# EAGLE design battery_18650_shield (EAGLE 9.5.2)
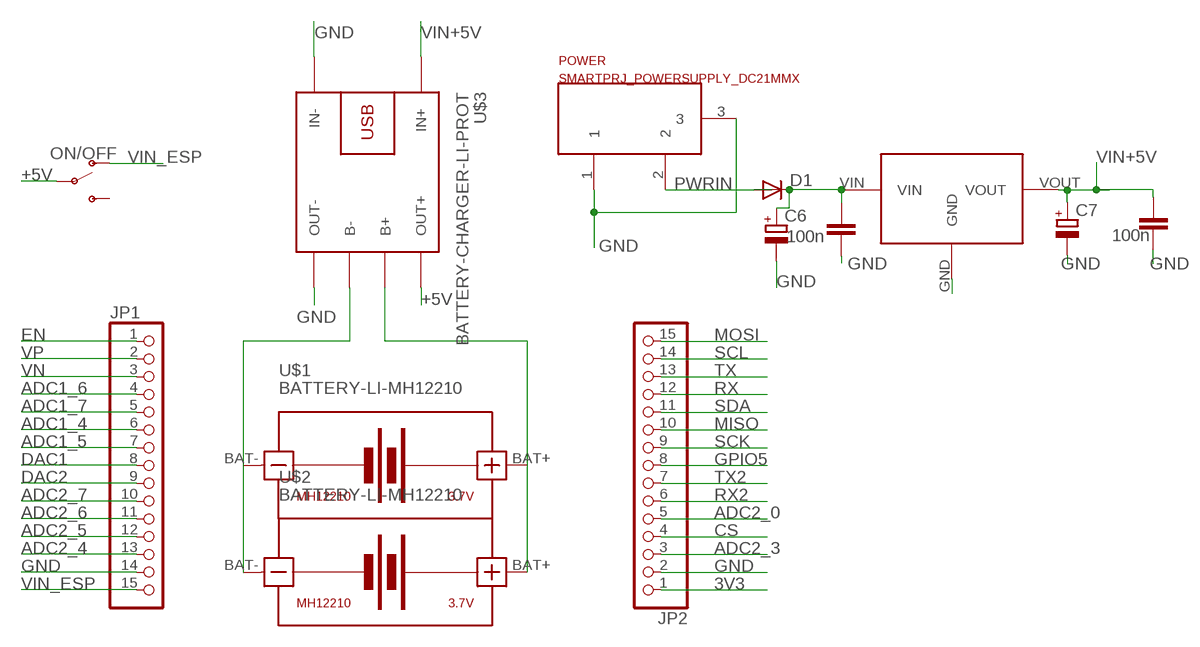
[diagram p0: schematic, sheet 1]

## Parts
C5  100n  C-EUC1206  [C1206]
C6  CPOL-EUD  [PANASONIC_D]
C7  CPOL-EUD  [PANASONIC_D]
C14  100n  C-EUC1206  [C1206]
D1  DIODE-SMB  [SMB]
JP1  PINHD-1X15  [1X15]
JP2  PINHD-1X15  [1X15]
ON/OFF  SWITCH-SPDT-PTH-11.6X4.0MM  [SWITCH_SPDT_PTH_11.6X4.0MM]
POWER  SMARTPRJ_POWERSUPPLY_DC21MMX  [SMARTPRJ_POWERSUPPLY_DC-21MM]
U$1  BATTERY-LI-MH12210  [BATTERY-LI-MH12210]
U$2  BATTERY-LI-MH12210  [BATTERY-LI-MH12210]
U$3  BATTERY-CHARGER-LI-PROT  [BATTERY-CHARGER-LI-PROT]
U$5  7805-TO263_7805  [7805-TO263_TO263]

## Nets
3V3: JP2.1
+5V [usbvcc]: ON/OFF.2(P) U$3.OUT+
ADC1_4: JP1.6
ADC1_5: JP1.7
ADC1_6: JP1.4
ADC1_7: JP1.5
ADC2_0: JP2.5
ADC2_3: JP2.3
ADC2_4: JP1.13
ADC2_5: JP1.12
ADC2_6: JP1.11
ADC2_7: JP1.10
CS: JP2.4
DAC1: JP1.8
DAC2: JP1.9
EN: JP1.1
GND: C5.1 C6.- C7.- C14.1 JP1.14 JP2.2 POWER.1 POWER.3 U$3.IN- U$3.OUT- U$5.GND
GPIO5: JP2.8
MISO: JP2.10
MOSI: JP2.15
N$1: U$1.BAT- U$2.BAT- U$3.B-
N$2: U$1.BAT+ U$2.BAT+ U$3.B+
PWRIN [power]: D1.A POWER.2
RX: JP2.12
RX2: JP2.6
SCK: JP2.9
SCL: JP2.14
SDA: JP2.11
TX: JP2.13
TX2: JP2.7
VIN: C5.2 C6.+ D1.C U$5.VIN
VIN+5V [usbvcc]: C7.+ C14.2 U$3.IN+ U$5.VOUT
VIN_ESP [usbvcc]: JP1.15 ON/OFF.1(O)
VN: JP1.3
VP: JP1.2
Unconnected: ON/OFF.3(S)

## Library data of the parts
C5 C14 = rcl:C-EU: CAPACITOR, European symbol
C6 C7 = rcl:CPOL-EU: POLARIZED CAPACITOR, European symbol
D1 = diode:DIODE-: DIODE
JP1 JP2 = pinhead:PINHD-1X15: PIN HEADER
ON/OFF = SparkFun-Switches:SWITCH-SPDT: Single Pole, Double Throw (SPDT) Switch Single-pole, double-throw (SPDT) switch. Variant Overview SMD-AYZ0202 Surface Mount DPDT Switch <https://www.sparkfun.com/products/597> (COM-00597) Used on e.g. LilyPad Arduino USB - ATmega32U4 Board <https://www.sparkfun.com/products/12049> PTH-11.6X4.0MM SPDT Mini Power Switch <https://www.sparkfun.com/products/102> (COM-00102) Used on e.g. SparkFun Simon Says - Through-Hole Soldering Kit <https://www.sparkfun.com/products/10547> (KIT-10547) PTH-11.6X4.0MM-KIT KIT version of SPDT Mini Power Switch - Simplifies soldering by removing tStop of switch pins - only one side can be soldered. PTH-11.6X4.0MM-LOCK LOCK version of SPDT Mini Power Switch - Offset pins hold switch in place for easier soldering. SMD-RIGHT-ANGLE Surface Mount Right Angle Switch <https://www.sparkfun.com/products/10860> (COM-10860) Used on e.g. SparkFun ESP8266 Thing <https://www.sparkfun.com/products/13231>; PROD_ID: SWCH-08261; SF_SKU: COM-00102
POWER = arduino_Uno_Rev3-02-TH:SMARTPRJ_POWERSUPPLY_DC21MM
U$1 U$2 = diy-modules:BATTERY-LI-MH12210: Lithium-Ion MH12210 Rechargeable Battery Panasonic NCR18650PF battery datasheet available here: https://industrial.panasonic.com/cdbs/www-data/pdf2/ACI4000/ACI4000C12.pdf Click here to find device on ebay.com <http://www.ebay.com/sch/ncr18650b+battery>
U$3 = diy-modules:BATTERY-CHARGER-LI-PROT: Lithium Battery 5V Charger with protection circuit More details available here: http://www.instructables.com/id/DIY-Lithium-ion-Battery-Charger/step4/TP4056-based-lithium-ion-battery-charger-module/ Click here to find device on ebay.com <http://www.ebay.com/sch/tp4056+charger+usb+protection>
U$5 = arduino_f:7805-TO263_7805

## Net classes
1 power: width 0.61 mm, drill 0.508 mm, clearance 0.152 mm
3 usbvcc: width 0.508 mm, drill 0.508 mm, clearance 0.152 mm

## Board
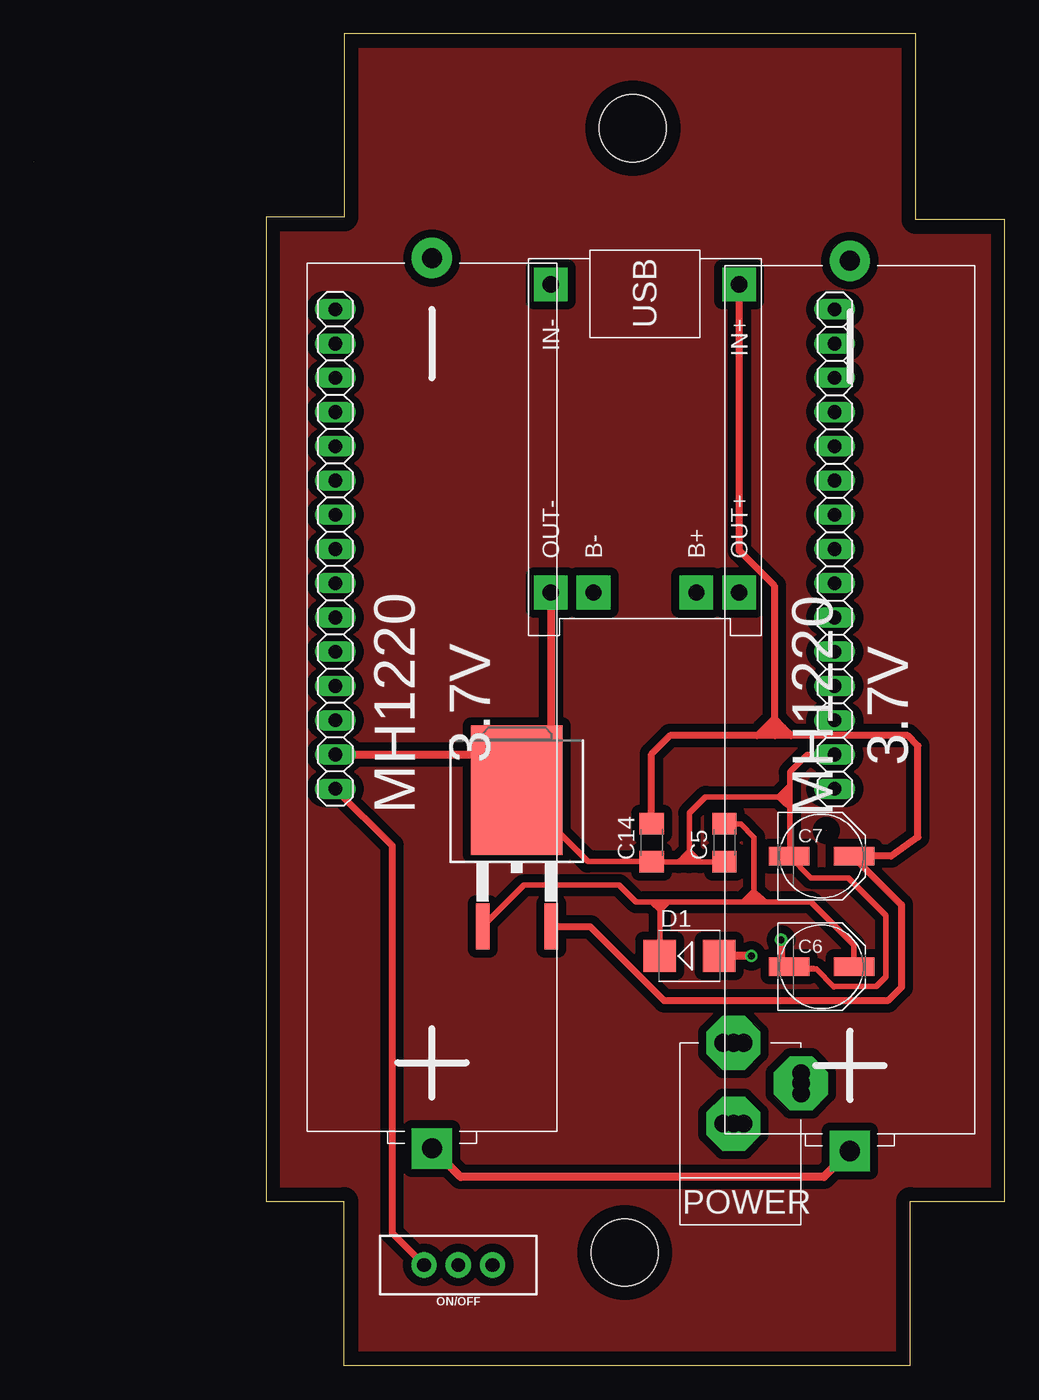
[diagram p1: board, top side]
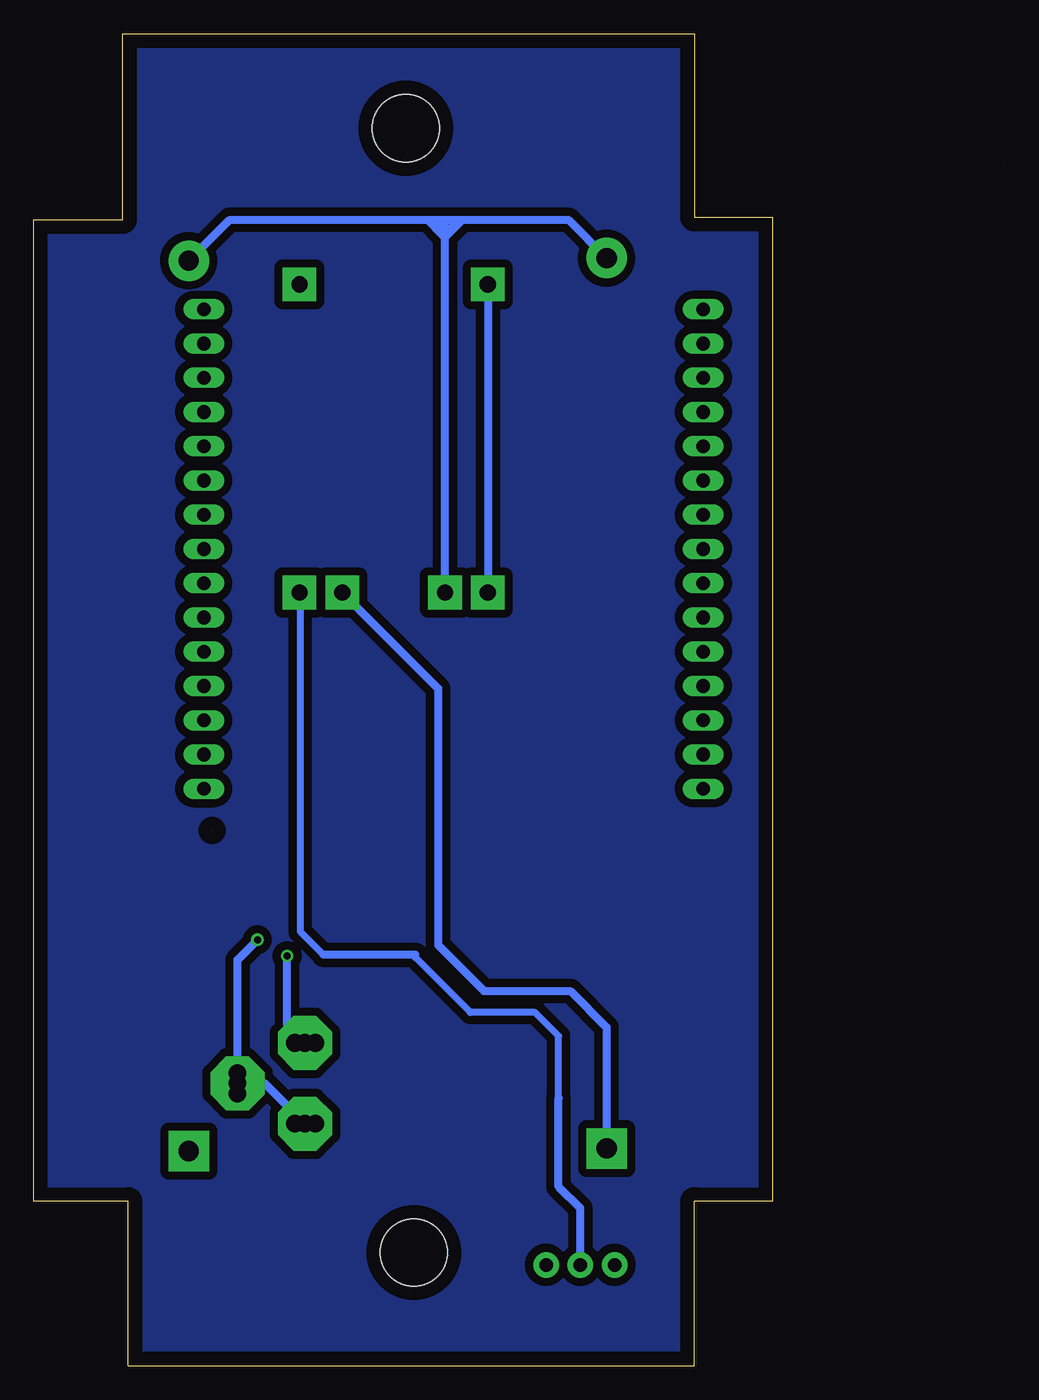
[diagram p2: board, bottom side, seen from below]

Size 72.04 x 98.8 mm. Coordinates in mm from the lower left corner, seen from the top.
Outline: 0,89.29 0,89.32
Outline: 58.8,39.72 58.8,39.69
Outline: 17.24,12.2 23.04,12.2 23.04,0 65.04,0 65.04,12.2 72.04,12.2 72.04,85 65.44,85 65.44,98.8 23.04,98.8 23.04,85.2 17.24,85.2 17.24,12.2
Copper layers (1*16): Top 0.035mm / dielectric 1.5mm / Bottom 0.035mm
Design rules "default": minimum track width 6mil, minimum drill 0.35mm, track to track 6mil, track to pad 6mil, pad to pad 6mil, via to via 6mil, smd to smd 6mil, copper to edge 40mil, drill to drill 6mil, minimum pad ring 10mil, minimum via ring 8mil, stop-mask expansion 4mil, vias tented up to drill 0mil, thermal gap 10mil
Holes 8 mm at -64.6,13.69 -64.8,92.69
Holes 5 mm at 43.84,8.4 44.44,91.8

### Footprints (pad centres in the part's own frame; a part is rotated, then mirrored left to right if it is on the bottom)
C1206 = smd 1.6 x 1.8: 1 -1.4,0; 2 1.4,0
PANASONIC_D = smd 3 x 1.4: + 2.4,0; - -2.4,0
SMB = smd 2.4 x 2.4: A 2.2,0; C -2.2,0
1X15 = drill 1.016 long: 1 -17.78,0; 2 -15.24,0; 3 -12.7,0; 4 -10.16,0; 5 -7.62,0; 6 -5.08,0; 7 -2.54,0; 8 0,0; 9 2.54,0; 10 5.08,0; 11 7.62,0; 12 10.16,0; 13 12.7,0; 14 15.24,0; 15 17.78,0
SWITCH_SPDT_PTH_11.6X4.0MM = drill 1.016 pad 1.88: 1 0,2.54; 2 0,0; 3 0,-2.54
SMARTPRJ_POWERSUPPLY_DC-21MM = drill 1.3 pad 4 octagon: 1 -5.08,-3.353; 2 -0.076,-6.35; 3 -0.076,-0.356 | drill 1.3: 4 -5.08,-4.115; 5 -5.08,-2.591; 6 -0.838,-0.356; 7 0.686,-0.356; 8 -0.838,-6.35; 9 0.686,-6.35
BATTERY-LI-MH12210 = drill 1.5 pad 3 square: BAT+ -33.02,0 | drill 1.5 pad 3: BAT- 33.02,0
BATTERY-CHARGER-LI-PROT = drill 1.2 pad 2.5 square: B+ 10.795,3.81; B- 10.795,-3.81; IN+ -12.065,6.985; IN- -12.065,-6.985; OUT+ 10.795,6.985; OUT- 10.795,-6.985
7805-TO263_TO263 = smd 6.8 x 9.6: GND 0,3.5 | smd 1 x 3.4: VIN -2.54,-6.6; VOUT 2.54,-6.6

### Placement (x,y rotation side)
C5  51.24,38.8 90 top
C6  58.44,29.6 0 top
C7  58.44,37.8 0 top
C14  45.84,38.8 90 top
D1  48.64,30.4 0 top
JP1  22.37,60.58 270 top
JP2  59.42,60.58 90 top
ON/OFF  31.49,7.48 90 top
POWER  51.84,17.6 180 top
U$1  29.54,49.14 90 top
U$2  60.54,48.94 90 top
U$3  45.34,68.14 270 top
U$5  35.84,39.2 0 top

### Tracks (layer width: path | path; a pad name or v marks a point on that pad's centre or on a via)
+5V
  Bottom 0.508: 50.54,30.48 52.26,32.21 52.26,57.33 U$3.OUT+ | 33.1,19.86 33.1,24.46 34.84,26.2 39.64,26.2 43.72,30.28 43.72,30.48
  Bottom 0.61: 33.1,19.86 33.1,13.29 31.49,11.68 ON/OFF.2 | 43.72,30.48 50.54,30.48
B
  pour Bottom (isolate 0.61): 17.44,12.4 23.24,12.4 23.24,0.2 64.84,0.2 64.84,12.4 71.84,12.4 71.84,84.8 65.24,84.8 65.24,98.6 23.24,98.6 23.24,85 17.44,85
GND  (via drill 0.51)
  Top 0.152: 46.04,37.37 45.86,37.37 C14.1 | 58.06,29.42 57.88,29.59 57.04,29.59 56.07,29.59 C6.- | 63.23,30.6 63.23,28.83 | 56.07,37.75 C7.- 56.07,37.82 56.07,38.59 56.11,38.62 | JP2.2 59.6,45.52 | 35.77,42.73 35.8,42.7 U$5.GND | 35.69,42.85 U$5.GND | 38.39,57.41 U$3.OUT- | 38.77,39.73 35.88,42.62 U$5.GND
  Top 0.406: JP2.2 57.38,45.34 56.07,44.03 56.07,43 | 56.07,43 56.07,42.6 | 56.07,42.6 56.07,42.2 | 56.07,42.2 56.07,41.4 | 56.07,41.4 56.07,37.75 | C5.1 51.21,37.37 49.44,37.37 | 49.44,37.37 48.64,37.37 | 48.64,37.37 47.84,37.37 | 47.84,37.37 46.04,37.37 | C14.1 41.1,37.4 38.77,39.73 | 56.07,42.2 55.27,42.2 | 55.27,42.2 49.84,42.2 48.64,41 48.64,38.17 | 48.64,38.17 48.64,37.37 | 47.84,37.37 48.16,37.68 | 48.16,37.68 48.64,38.17 | 48.64,38.17 49.12,37.68 | 49.12,37.68 49.44,37.37 | 48.16,37.68 49.12,37.68 | 56.07,43 55.27,42.2 | 55.27,42.2 55.76,41.72 | 55.76,41.72 56.07,41.4 | 56.07,42.6 55.76,42.28 55.76,41.72 | C7.- 57.64,36.2 60.44,36.2 63.23,33.41 63.23,28.83 62.52,28.12 59.36,28.12 58.06,29.42 57.22,29.42 57.04,29.59
  Top 0.61: v55.44,31.6 55.44,30.2 C6.- | JP1.14 34.38,45.34 34.84,45.8 35.77,44.87 35.77,42.73 | U$3.OUT- 38.35,45.51 35.69,42.85
  Bottom 0.61: POWER.3 54.91,20.95 POWER.1 56.92,30.12 v55.44,31.6 | U$3.IN- U$3.OUT-
N$1
  Bottom 0.61: U$2.BAT- 57.5,85 42.84,85 | U$1.BAT- 32.38,85 40.24,85 | 42.84,85 42.04,85 | 42.04,85 41.64,85 | 41.64,85 40.44,85 | 40.44,85 40.24,85 | U$3.B- 41.53,83.69 | 41.53,84.49 41.53,84.89 41.64,85 | 41.53,83.69 41.74,83.9 | 41.74,83.9 42.84,85 | 41.74,83.9 41.54,83.9 40.44,85 | 41.53,83.71 41.53,84.49 | 41.53,84.49 42.04,85 | 41.53,83.69 41.53,83.71 | 41.53,83.71 40.24,85
N$2
  Top 0.152: 29.56,16.11 U$1.BAT+
  Top 0.61: U$2.BAT+ 58.62,14 31.66,14 29.56,16.11
  Bottom 0.61: U$3.B+ 42.04,50.23 42.04,31.2 38.64,27.8 32.24,27.8 29.54,25.1 U$1.BAT+
PWRIN  (via drill 0.51)
  Top 0.61: v53.24,30.4 D1.A
  Bottom 0.61: POWER.2 53.24,25.27 v53.24,30.4
T
  pour Top (isolate 0.61): 17.44,12.4 23.24,12.4 23.24,0.2 64.84,0.2 64.84,12.4 71.84,12.4 71.84,84.8 65.24,84.8 65.24,98.6 23.24,98.6 23.24,85 17.44,85
VIN
  Top 0.152: 51.27,39.42 51.27,40.19 C5.2 | 46.47,30.43 D1.C 46.4,30.43 | 60.8,29.67 C6.+ | 33.37,32.64 U$5.VIN
  Top 0.406: U$5.VIN 36.36,35.66 43.43,35.66 44.68,34.4 45.84,34.4 | C6.+ 60.84,31.2 57.64,34.4 54.24,34.4 | 45.84,34.4 46.44,34.4 | 46.44,34.4 47.04,34.4 | 47.04,34.4 52.64,34.4 | 52.64,34.4 53.44,34.4 | 53.44,34.4 54.24,34.4 | D1.C 46.44,33.8 | 46.44,33.8 46.44,34.4 | C5.2 52.44,40.2 53.44,39.2 53.44,35.2 | 53.44,35.2 53.44,34.4 | 52.64,34.4 52.94,34.7 | 52.94,34.7 53.44,35.2 | 53.44,35.2 53.94,34.7 | 53.94,34.7 54.24,34.4 | 52.94,34.7 53.94,34.7 | 45.84,34.4 46.44,33.8 | 46.44,33.8 47.04,34.4
VIN+5V
  Top 0.508: C14.2 45.84,45.37 47.21,46.74 53.67,46.74 | 56.19,46.74 64.84,46.74 65.6,45.98 65.6,39.21 63.61,37.8 C7.+ 60.95,37.6 64.36,34.19 64.36,28.08 63.35,27.07 46.79,27.07 41.29,32.57 38.39,32.57 U$5.VOUT | 56.19,46.74 55.01,46.74 | 55.01,46.74 53.67,46.74 | 54.93,48 54.93,46.97 55.01,46.74 | 54.93,48 54.93,57.87 52.34,60.46 U$3.IN+ | 54.93,48 54.08,47.16 | 54.08,47.16 53.67,46.74 | 54.93,48 55.58,47.35 | 55.58,47.35 56.19,46.74 | 54.08,47.16 55.39,47.16 55.58,47.35
VIN_ESP
  Top 0.508: ON/OFF.1 28.95,7.5 26.58,9.86 26.58,38.59 JP1.15